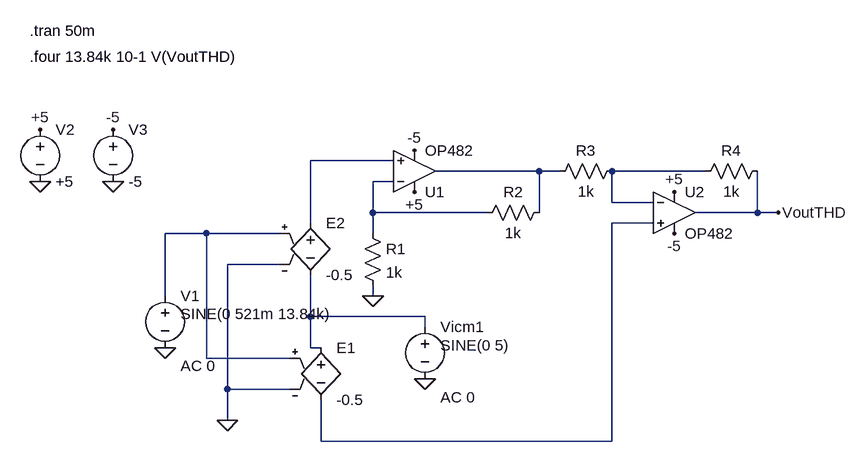
[diagram p0: schematic Etaj1THD.asc]
Etaj1THD.asc, the LTspice schematic file:
Version 4.1
SHEET 1 880 680
WIRE 64 -64 -64 -64
WIRE 288 -48 128 -48
WIRE 320 -48 288 -48
WIRE 544 -48 400 -48
WIRE 64 -32 32 -32
WIRE 400 0 400 -48
WIRE 464 0 400 0
WIRE 32 16 32 -32
WIRE 208 16 32 16
WIRE 288 16 288 -48
WIRE 624 16 624 -48
WIRE 624 16 528 16
WIRE 656 16 624 16
WIRE -64 32 -64 -64
WIRE 464 32 400 32
WIRE -224 48 -288 48
WIRE -112 48 -224 48
WIRE 32 48 32 16
WIRE -112 96 -192 96
WIRE -288 144 -288 48
WIRE 32 144 32 128
WIRE -64 176 -64 112
WIRE 112 176 -64 176
WIRE 112 192 112 176
WIRE -64 224 -64 176
WIRE -48 224 -64 224
WIRE -224 240 -224 48
WIRE -96 240 -224 240
WIRE -192 288 -192 96
WIRE -96 288 -192 288
WIRE -192 336 -192 288
WIRE -48 368 -48 304
WIRE 400 368 400 32
WIRE 400 368 -48 368
FLAG 32 144 0
FLAG 96 -16 +5
FLAG 96 -80 -5
FLAG 496 48 -5
FLAG 496 -16 +5
FLAG -192 336 0
FLAG 112 272 0
FLAG 656 16 VoutTHD
FLAG -288 224 0
FLAG -480 -32 0
FLAG -368 -32 0
FLAG -480 -112 +5
FLAG -368 -112 -5
SYMBOL OpAmps\\OP482 96 16 M180
SYMATTR InstName U1
SYMBOL OpAmps\\OP482 496 -48 R0
SYMATTR InstName U2
SYMBOL res 16 32 R0
SYMATTR InstName R1
SYMATTR Value 1k
SYMBOL res 304 0 R90
WINDOW 0 0 56 VBottom 2
WINDOW 3 32 56 VTop 2
SYMATTR InstName R2
SYMATTR Value 1k
SYMBOL res 416 -64 R90
WINDOW 0 0 56 VBottom 2
WINDOW 3 32 56 VTop 2
SYMATTR InstName R3
SYMATTR Value 1k
SYMBOL res 640 -64 R90
WINDOW 0 0 56 VBottom 2
WINDOW 3 32 56 VTop 2
SYMATTR InstName R4
SYMATTR Value 1k
SYMBOL e -48 208 R0
SYMATTR InstName E1
SYMATTR Value -0.5
SYMBOL e -64 16 R0
SYMATTR InstName E2
SYMATTR Value -0.5
SYMBOL voltage 112 176 R0
WINDOW 123 24 124 Left 2
WINDOW 39 0 0 Left 0
WINDOW 3 24 44 Left 2
SYMATTR Value2 AC 0
SYMATTR Value SINE(0 5)
SYMATTR InstName Vicm1
SYMBOL voltage -288 128 R0
WINDOW 123 24 124 Left 2
WINDOW 39 0 0 Left 0
WINDOW 3 24 44 Left 2
SYMATTR Value2 AC 0
SYMATTR Value SINE(0 521m 13.84k)
SYMATTR InstName V1
SYMBOL voltage -480 -128 R0
SYMATTR InstName V2
SYMATTR Value +5
SYMBOL voltage -368 -128 R0
SYMATTR InstName V3
SYMATTR Value -5
TEXT -496 -224 Left 2 !.four 13.84k 10-1 V(VoutTHD)
TEXT -496 -264 Left 2 !.tran 50m

The netlist it stands for:
* Etaj1THD.asc
X§U1 N001 N004 +5 -5 N002 OP482  ; pins In+ In- V+ V- OUT
X§U2 N005 N003 +5 -5 VoutTHD OP482  ; pins In+ In- V+ V- OUT
R1 N004 0 1k
R2 N002 N004 1k
R3 N003 N002 1k
R4 VoutTHD N003 1k
E1 N007 N005 N006 0 -0.5
E2 N001 N007 N006 0 -0.5
Vicm1 N007 0 SINE(0 5) AC 0
V1 N006 0 SINE(0 521m 13.84k) AC 0
V2 +5 0 +5
V3 -5 0 -5
.four 13.84k 10-1 V(VoutTHD)
.tran 50m
.backanno
.end